# EAGLE board BEP33_6panel_90Grad (EAGLE 6.5.0), part 1 of 4
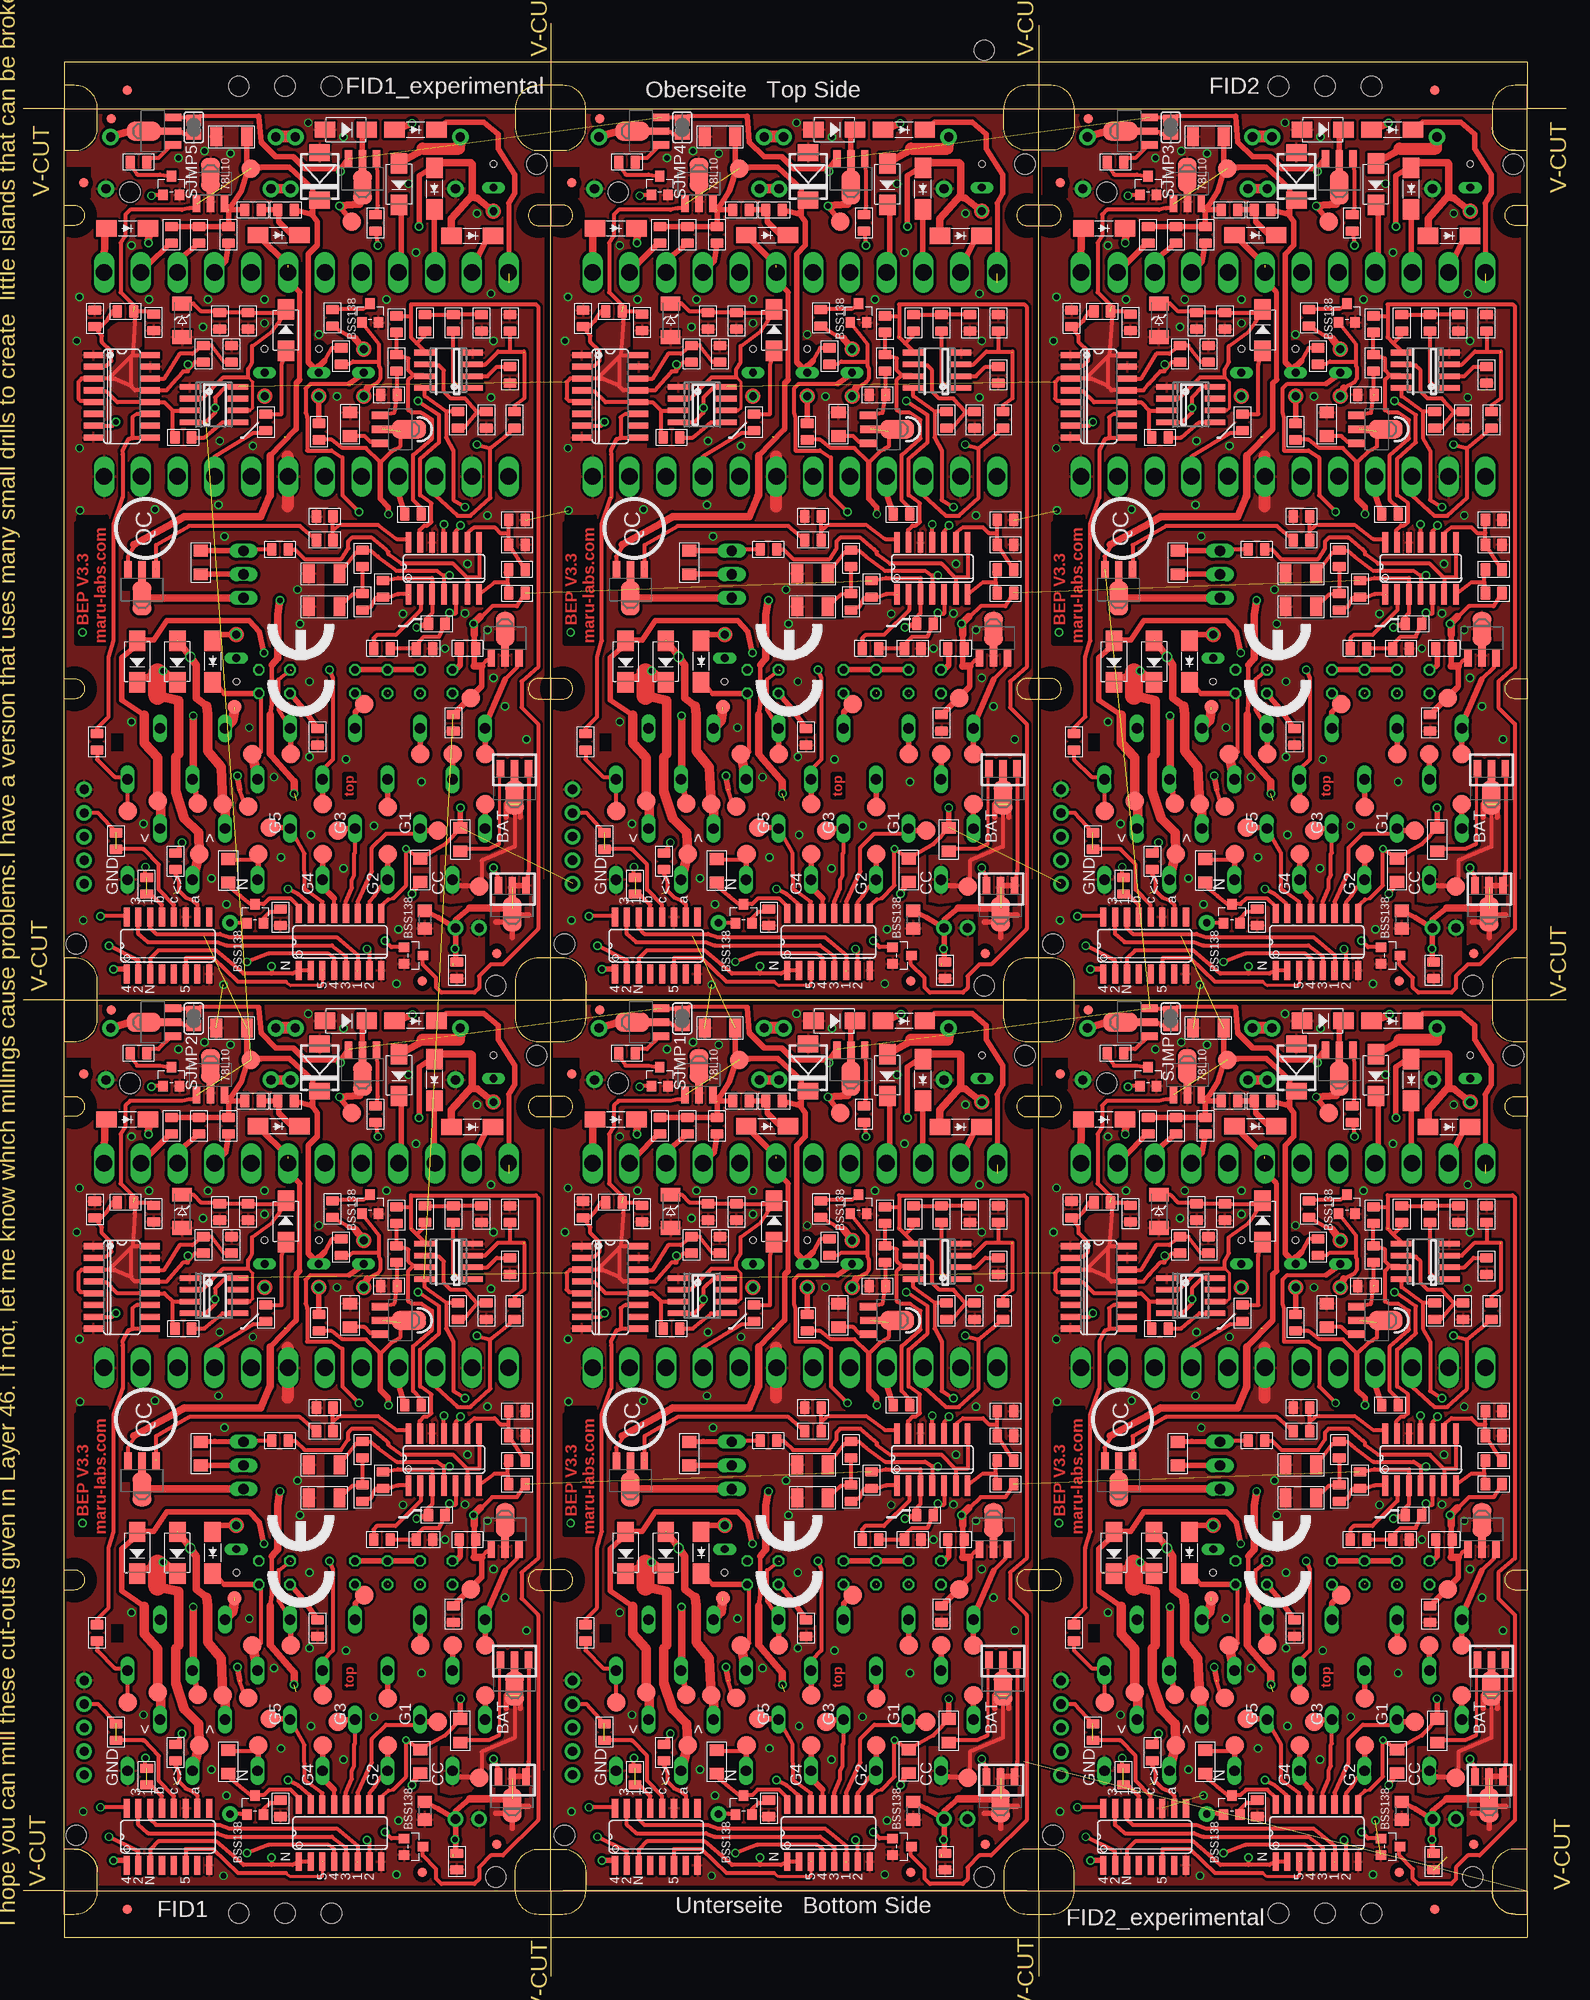
[diagram p13: board, top side]
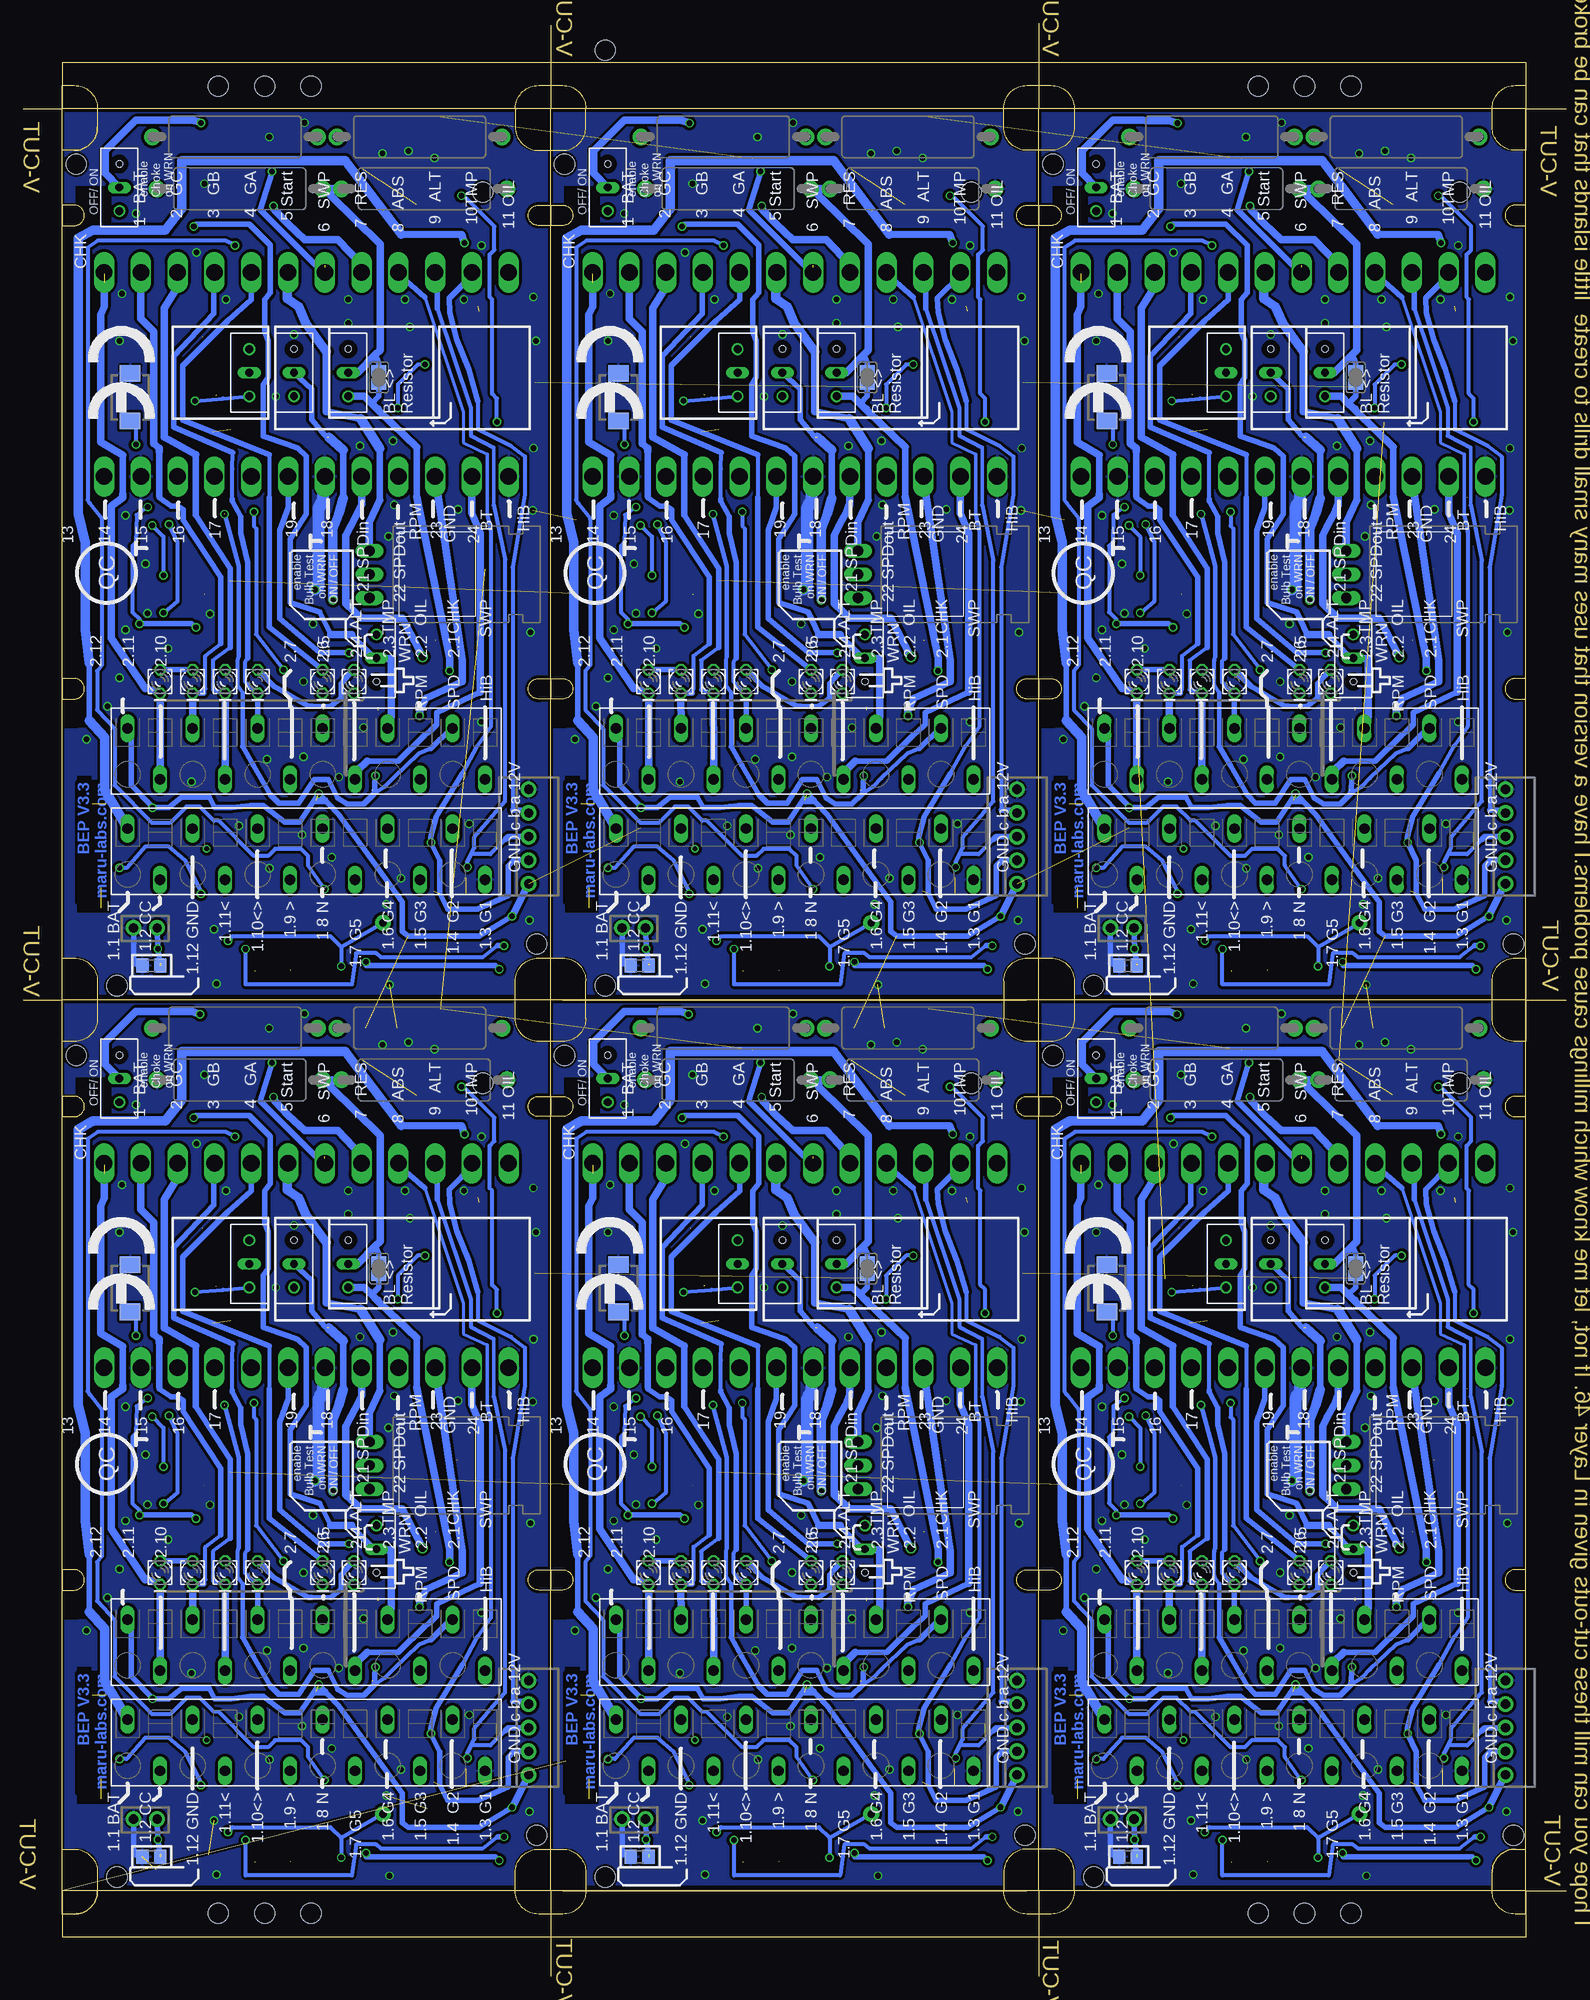
[diagram p14: board, bottom side, seen from below]

Size 166.2 x 210.4 mm. Coordinates in mm from the lower left corner, seen from the top.
Outline: 43 segments
Copper layers (1*16): Top 0.035mm / dielectric 1.5mm / Bottom 0.035mm
Design rules "Vorlage BEP3 und hoeher multi-cb_035um-cu": minimum track width 6mil, minimum drill 12mil, track to track 12mil, track to pad 12mil, pad to pad 6mil, via to via 6mil, smd to smd 6mil, copper to edge 10mil, drill to drill 8mil, minimum pad ring 8mil, minimum via ring 6mil, stop-mask expansion 3mil, vias tented up to drill 0mil, thermal gap 8mil
Holes 2.18 mm at 156.1,10.7 116.7,96.2 160.5,99.2 110.9,15.2 23.2,6.8 145.2,6.8 140.2,6.8 28.2,6.8 103.5,207.5 23.2,203.6 145.2,203.6 140.2,203.6 28.2,203.6 135.2,6.8 33.2,6.8 33.2,203.6 135.2,203.6 103.5,10.7 64.1,96.2 107.9,99.2 58.3,15.2 50.9,10.7 11.5,96.2 55.3,99.2 5.7,15.2 156.1,106.7 116.7,192.2 160.5,195.2 110.9,111.2 103.5,106.7 64.1,192.2 107.9,195.2 58.3,111.2 50.9,106.7 11.5,192.2 55.3,195.2 5.7,111.2
tRestrict: area 137.7,50.2 to 141,56.7; area 114.7,36 to 116,37.9; area 143.4,67.6 to 145.4,69.4; area 115.8,53.3 to 120.1,54.7; area 154.8,46.5 to 159.3,47.8; area 156.1,19.2 to 159.6,20.6; area 138.4,97.6 to 139.6,99.2; area 109.8,95.6 to 112.5,98.9; area 119.8,68.7 to 121,72.9; area 126.3,22.6 to 128,23.7; area 109.4,16.5 to 109.4,91.2; area 111.1,47.6 to 114.2,61.3; 96 more areas
bRestrict: area 156.9,18.6 to 160.4,28.8; area 158.9,28.7 to 160.4,33.3; area 158.9,38.5 to 161.1,45; area 156.7,90.8 to 160.5,96.8; area 109.5,41.5 to 111.9,43.9; area 109.4,41.3 to 110.8,44.1; area 109.5,92.5 to 111.9,94.9; area 109.4,92.3 to 110.8,95.1; area 159.4,92.4 to 162,95; area 159.3,41.4 to 162,44; area 160.3,38.5 to 162,45.6; area 109.4,100.8 to 113.1,105; 72 more areas
Milling: 188 lines

## Footprints (pad centres in the part's own frame; a part is rotated, then mirrored left to right if it is on the bottom)
12-PIN = drill 1.118 long: 1 19.25,-2.45; 2 15.75,3.05; 3 12.25,-2.45; 4 8.75,3.05; 5 5.25,-2.45; 6 1.75,3.05; 7 -1.75,-2.45; 8 -5.25,3.05; 9 -8.75,-2.45; 10 -12.25,3.05; 11 -15.75,-2.45; 12 -19.25,3.05
B2.0 = smd 2 x 2: TP 0,0
C1206 = smd 1.27 x 2.032: 1 -1.651,0; 2 1.651,0
C0805 = smd 1.397 x 1.016: 1 0,0.889; 2 0,-0.889
DO-214AC_SLIM = smd 2.2 x 1.77: 1 -2.242,0; 2 2.242,0
DO-214AC = smd 2.2 x 1.77: 1 -2.242,0; 2 2.242,0
SOD-123_MINI-SMA = smd 1.5 x 2.1: A 1.8,0; C -1.8,0
DO214AA = smd 1.8 x 2.2: A 2.55,0; C -2.55,0
DO214AA_BI = smd 1.8 x 2.2: A 2.45,0; C -2.65,0
FIDUCIAL_1MM = smd 1 x 1: 1 0,0
FIDUCIAL_1MM_WITH_SOLDERMASK = smd 1 x 1: 1 0,0
SO16 = smd 0.66 x 2.032: 1 -4.445,-3.073; 2 -3.175,-3.073; 3 -1.905,-3.073; 4 -0.635,-3.073; 5 0.635,-3.073; 6 1.905,-3.073; 7 3.175,-3.073; 8 4.445,-3.073; 9 4.445,3.073; 10 3.175,3.073; 11 1.905,3.073; 12 0.635,3.073; 13 -0.635,3.073; 14 -1.905,3.073; 15 -3.175,3.073; 16 -4.445,3.073
TO220H_NOHOLE = drill 1.118 long: 1 -2.54,-10.16; 2 0,-10.16; 3 2.54,-10.16
SO14 = smd 0.6 x 2.2: 1 -3.81,-2.8; 2 -2.54,-2.8; 3 -1.27,-2.8; 4 0,-2.8; 5 1.27,-2.8; 6 2.54,-2.8; 7 3.81,-2.8; 8 3.81,2.8; 9 2.54,2.8; 10 1.27,2.8; 11 0,2.8; 12 -1.27,2.8; 13 -2.54,2.8; 14 -3.81,2.8
SOT89_ROUND = smd 0.8 x 1.8: 1 -1.499,-2.181; 3 1.499,-2.181 | smd 0.8 x 2.3: 2 0,-1.927 | smd 2.032 x 3.65: 2@1 0,0.94
SO08 = smd 0.6 x 2.2: 1 -1.905,-2.6; 2 -0.635,-2.6; 3 0.635,-2.6; 4 1.905,-2.6; 5 1.905,2.6; 6 0.635,2.6; 7 -0.635,2.6; 8 -1.905,2.6
JP2_SMALLPADS = drill 0.85: 1 -2.54,0 | drill 0.85 long: 2 0,0 | hole 0.7: 2.54,0
JP2_ORIG_SMALLPADS = drill 0.85: 1 -2.54,0; 3 2.54,0 | drill 0.85 long: 2 0,0
LD260 = drill 0.813 octagon: A -1.27,0; K 1.27,0
SOT-23 = smd 1.016 x 1.143: 1 -0.889,-1.016; 2 0.889,-1.016; 3 0,1.016
SOT89 = smd 0.8 x 1.8: 1 -1.499,-2.181; 3 1.499,-2.181 | smd 0.8 x 2.3: 2 0,-1.927 | smd 2.032 x 3.65: 2@1 0,0.94
R0805 = smd 1.397 x 1.016: 1 0,0.889; 2 0,-0.889
R1206 = smd 1.27 x 1.524: 1 -1.27,0; 2 1.27,0
V235/17_1MM = drill 1 pad 1.778: 1 -8.89,0; 2 8.89,0
R0805' = smd 1.3 x 1.5: 1 -0.95,0; 2 0.95,0
SJ = smd 1.2 x 1.6: 1 -0.725,0; 2 0.725,0
SJ' = smd 1.168 x 1.6: 1 -0.762,0; 2 0.762,0
B1,27 = smd 1.5 x 1.5: TP 0,0
24-PIN_V2 = drill 1.778 long: 1 -21.78,-11; 2 -17.82,-11; 3 -13.86,-11; 4 -9.9,-11; 5 -5.94,-11; 6 -1.98,-11; 7 1.98,-11; 8 5.94,-11; 9 9.9,-11; 10 13.86,-11; 11 17.82,-11; 12 21.78,-11; 13 -21.78,11; 14 -17.82,11; 15 -13.86,11; 16 -9.9,11; 17 -5.94,11; 18 -1.98,11; 19 1.98,11; 20 5.94,11; 21 9.9,11; 22 13.86,11; 23 17.82,11; 24 21.78,11
22-23-2051 = drill 1 pad 1.676: 1 -5.08,0; 2 -2.54,0; 3 0,0; 4 2.54,0; 5 5.08,0
22-23-2021 = drill 1 pad 1.676: 1 -1.27,0; 2 1.27,0

## Placement (x,y rotation side)
1  [12-PIN]  135.7,25.19 180 bottom
2  [12-PIN]  135.7,35.98 180 bottom
3  [12-PIN]  83.1,25.19 180 bottom
4  [12-PIN]  83.1,35.98 180 bottom
5  [12-PIN]  30.5,25.19 180 bottom
6  [12-PIN]  30.5,35.98 180 bottom
6V  TPSB2.0  [B2.0]  153.42,41.7 90 top
6V1  TPSB2.0  [B2.0]  100.82,41.7 90 top
6V2  TPSB2.0  [B2.0]  48.22,41.7 90 top
6V3  TPSB2.0  [B2.0]  153.42,137.7 90 top
6V4  TPSB2.0  [B2.0]  100.82,137.7 90 top
6V5  TPSB2.0  [B2.0]  48.22,137.7 90 top
7  [12-PIN]  135.7,121.19 180 bottom
8  [12-PIN]  135.7,131.98 180 bottom
9  [12-PIN]  83.1,121.19 180 bottom
10  [12-PIN]  83.1,131.98 180 bottom
10V  TPSB2.0  [B2.0]  129.7,98.7 90 top
10V1  TPSB2.0  [B2.0]  77.1,98.7 90 top
10V2  TPSB2.0  [B2.0]  24.5,98.7 90 top
10V3  TPSB2.0  [B2.0]  129.7,194.7 90 top
10V4  TPSB2.0  [B2.0]  77.1,194.7 90 top
10V5  TPSB2.0  [B2.0]  24.5,194.7 90 top
11  [12-PIN]  30.5,121.19 180 bottom
12  [12-PIN]  30.5,131.98 180 bottom
C1  100u  [C1206]  85.01,51.54 180 top
C2  10u  [C1206]  127.64,102.16 180 top
C3  100u  [C1206]  85.01,55.1 180 top
C4  100nF,  [C0805]  98.92,39.03 0 top
C5  4.7u  [C0805]  105.01,82.1 180 top
C6  100nF.  [C0805]  105.77,58.21 90 top
C7  100nF.  [C0805]  85.07,61.26 90 top
C8  2.2nF  [C0805]  76.82,82.34 180 top
C9  100nF  [C0805]  66.65,82.16 0 top
C10  100nF  [C0805]  75.04,78.78 180 top
C11  100nF,  [C0805]  101.96,82.1 0 top
C12  4.7u  [C0805]  60.31,82.61 0 top
C13  10u  [C1206]  75.04,102.16 180 top
C14  100u  [C1206]  32.41,51.54 180 top
C15  4.7u  [C0805]  112.91,82.61 0 top
C16  100u  [C1206]  32.41,55.1 180 top
C17  100nF,  [C0805]  46.32,39.03 0 top
C18  4.7u  [C0805]  52.41,82.1 180 top
C19  100nF.  [C0805]  53.17,58.21 90 top
C20  100nF.  [C0805]  32.47,61.26 90 top
C21  2.2nF  [C0805]  24.22,82.34 180 top
C22  100nF  [C0805]  14.05,82.16 0 top
C23  100nF  [C0805]  22.44,78.78 180 top
C24  100nF,  [C0805]  49.36,82.1 0 top
C25  4.7u  [C0805]  7.71,82.61 0 top
C26  10u  [C1206]  22.44,102.16 180 top
C27  100u  [C1206]  137.61,147.54 180 top
C28  100u  [C1206]  137.61,151.1 180 top
C29  100nF,  [C0805]  151.52,135.03 0 top
C30  4.7u  [C0805]  157.61,178.1 180 top
C31  100nF.  [C0805]  158.37,154.21 90 top
C32  100nF.  [C0805]  137.67,157.26 90 top
C33  2.2nF  [C0805]  129.42,178.34 180 top
C34  100nF  [C0805]  119.25,178.16 0 top
C35  100nF  [C0805]  127.64,174.78 180 top
C36  100nF,  [C0805]  154.56,178.1 0 top
C37  4.7u  [C0805]  112.91,178.61 0 top
C38  10u  [C1206]  127.64,198.16 180 top
C39  100u  [C1206]  85.01,147.54 180 top
C40  100u  [C1206]  85.01,151.1 180 top
C41  100nF,  [C0805]  98.92,135.03 0 top
C42  4.7u  [C0805]  105.01,178.1 180 top
C43  100nF.  [C0805]  105.77,154.21 90 top
C44  100nF.  [C0805]  85.07,157.26 90 top
C45  2.2nF  [C0805]  76.82,178.34 180 top
C46  100nF  [C0805]  66.65,178.16 0 top
C47  100nF  [C0805]  75.04,174.78 180 top
C48  100nF,  [C0805]  101.96,178.1 0 top
C49  4.7u  [C0805]  60.31,178.61 0 top
C50  10u  [C1206]  75.04,198.16 180 top
C51  100u  [C1206]  32.41,147.54 180 top
C52  100u  [C1206]  32.41,151.1 180 top
C53  100nF,  [C0805]  46.32,135.03 0 top
C54  4.7u  [C0805]  52.41,178.1 180 top
C55  100nF.  [C0805]  53.17,154.21 90 top
C56  100nF.  [C0805]  32.47,157.26 90 top
C57  2.2nF  [C0805]  24.22,178.34 180 top
C58  100nF  [C0805]  14.05,178.16 0 top
C59  100nF  [C0805]  22.44,174.78 180 top
C60  100nF,  [C0805]  49.36,178.1 0 top
C61  4.7u  [C0805]  7.71,178.61 0 top
C62  10u  [C1206]  22.44,198.16 180 top
C101  4.7u  [C0805]  157.61,82.1 180 top
C102  100nF  [C0805]  119.25,82.16 0 top
C103  100nF,  [C0805]  154.56,82.1 0 top
C104  100nF,  [C0805]  151.52,39.03 0 top
C105  100nF.  [C0805]  158.37,58.21 90 top
C106  100nF.  [C0805]  137.67,61.26 90 top
C107  100u  [C1206]  137.61,51.54 180 top
C108  100u  [C1206]  137.61,55.1 180 top
C109  2.2nF  [C0805]  129.42,82.34 180 top
C110  100nF  [C0805]  127.64,78.78 180 top
D1  1N5817  [DO-214AC_SLIM]  132.71,91.56 0 top
D2  1N5817.  [DO-214AC_SLIM]  116.42,92.3 0 top
D3  1N4007,  [DO-214AC]  69.2,45.64 270 top
D4  Zen11  [SOD-123_MINI-SMA]  122.32,82.4 270 top
D5  1N4007,  [DO-214AC]  64.88,45.64 270 top
D6  1N4007.  [DO-214AC]  93.07,97.07 270 top
D7  1N5817  [DO-214AC_SLIM]  96.88,96.56 270 top
D8  1N5817.  [DO-214AC_SLIM]  100.96,91.5 0 top
D9  1N5817.  [DO-214AC_SLIM]  94.85,102.93 0 top
D10  1N5817  [DO-214AC_SLIM]  73.01,45.64 270 top
D11  1N4007.  [DO-214AC]  87.36,102.93 0 top
D12  1N4007  [DO-214AC]  80.88,81.32 90 top
D13  Zen15  [DO214AA]  84.53,97.89 90 top
D14  SM6TDO214AA_BI  [DO214AA_BI]  102.09,74.21 90 bottom
D15  1N5817  [DO-214AC_SLIM]  80.11,91.56 0 top
D16  1N5817.  [DO-214AC_SLIM]  63.82,92.3 0 top
D17  Zen11  [SOD-123_MINI-SMA]  69.72,82.4 270 top
D18  1N4007,  [DO-214AC]  16.6,45.64 270 top
D19  1N4007,  [DO-214AC]  12.28,45.64 270 top
D20  1N4007.  [DO-214AC]  40.47,97.07 270 top
D21  1N5817  [DO-214AC_SLIM]  44.28,96.56 270 top
D22  1N5817.  [DO-214AC_SLIM]  48.36,91.5 0 top
D23  1N5817.  [DO-214AC_SLIM]  42.25,102.93 0 top
D24  1N5817  [DO-214AC_SLIM]  20.41,45.64 270 top
D25  1N4007.  [DO-214AC]  34.76,102.93 0 top
D26  1N4007  [DO-214AC]  28.28,81.32 90 top
D27  Zen15  [DO214AA]  31.93,97.89 90 top
D28  SM6TDO214AA_BI  [DO214AA_BI]  49.49,74.21 90 bottom
D29  1N5817  [DO-214AC_SLIM]  27.51,91.56 0 top
D30  1N5817.  [DO-214AC_SLIM]  11.22,92.3 0 top
D31  Zen11  [SOD-123_MINI-SMA]  17.12,82.4 270 top
D32  1N4007,  [DO-214AC]  121.8,141.64 270 top
D33  1N4007,  [DO-214AC]  117.48,141.64 270 top
D34  1N4007.  [DO-214AC]  145.67,193.07 270 top
D35  1N5817  [DO-214AC_SLIM]  149.48,192.56 270 top
D36  1N5817.  [DO-214AC_SLIM]  153.56,187.5 0 top
D37  1N5817.  [DO-214AC_SLIM]  147.45,198.93 0 top
D38  1N5817  [DO-214AC_SLIM]  125.61,141.64 270 top
D39  1N4007.  [DO-214AC]  139.96,198.93 0 top
D40  1N4007  [DO-214AC]  133.48,177.32 90 top
D41  Zen15  [DO214AA]  137.13,193.89 90 top
D42  SM6TDO214AA_BI  [DO214AA_BI]  154.69,170.21 90 bottom
D43  1N5817  [DO-214AC_SLIM]  132.71,187.56 0 top
D44  1N5817.  [DO-214AC_SLIM]  116.42,188.3 0 top
D45  Zen11  [SOD-123_MINI-SMA]  122.32,178.4 270 top
D46  1N4007,  [DO-214AC]  69.2,141.64 270 top
D47  1N4007,  [DO-214AC]  64.88,141.64 270 top
D48  1N4007.  [DO-214AC]  93.07,193.07 270 top
D49  1N5817  [DO-214AC_SLIM]  96.88,192.56 270 top
D50  1N5817.  [DO-214AC_SLIM]  100.96,187.5 0 top
D51  1N5817.  [DO-214AC_SLIM]  94.85,198.93 0 top
D52  1N5817  [DO-214AC_SLIM]  73.01,141.64 270 top
D53  1N4007.  [DO-214AC]  87.36,198.93 0 top
D54  1N4007  [DO-214AC]  80.88,177.32 90 top
D55  Zen15  [DO214AA]  84.53,193.89 90 top
D56  SM6TDO214AA_BI  [DO214AA_BI]  102.09,170.21 90 bottom
D57  1N5817  [DO-214AC_SLIM]  80.11,187.56 0 top
D58  1N5817.  [DO-214AC_SLIM]  63.82,188.3 0 top
D59  Zen11  [SOD-123_MINI-SMA]  69.72,178.4 270 top
D60  1N4007,  [DO-214AC]  16.6,141.64 270 top
D61  1N4007,  [DO-214AC]  12.28,141.64 270 top
D62  1N4007.  [DO-214AC]  40.47,193.07 270 top
D63  1N5817  [DO-214AC_SLIM]  44.28,192.56 270 top
D64  1N5817.  [DO-214AC_SLIM]  48.36,187.5 0 top
D65  1N5817.  [DO-214AC_SLIM]  42.25,198.93 0 top
D66  1N5817  [DO-214AC_SLIM]  20.41,141.64 270 top
D67  1N4007.  [DO-214AC]  34.76,198.93 0 top
D68  1N4007  [DO-214AC]  28.28,177.32 90 top
D69  Zen15  [DO214AA]  31.93,193.89 90 top
D70  SM6TDO214AA_BI  [DO214AA_BI]  49.49,170.21 90 bottom
D71  1N5817  [DO-214AC_SLIM]  27.51,187.56 0 top
D72  1N5817.  [DO-214AC_SLIM]  11.22,188.3 0 top
D73  Zen11  [SOD-123_MINI-SMA]  17.12,178.4 270 top
D101  Zen15  [DO214AA]  137.13,97.89 90 top
D102  1N4007,  [DO-214AC]  121.8,45.64 270 top
D103  1N4007,  [DO-214AC]  117.48,45.64 270 top
D104  SM6TDO214AA_BI  [DO214AA_BI]  154.69,74.21 90 bottom
D105  1N4007.  [DO-214AC]  139.96,102.93 0 top
D106  1N4007.  [DO-214AC]  145.67,97.07 270 top
D107  1N5817  [DO-214AC_SLIM]  149.48,96.56 270 top
D108  1N5817.  [DO-214AC_SLIM]  153.56,91.5 0 top
D109  1N5817.  [DO-214AC_SLIM]  147.45,102.93 0 top
D110  1N5817  [DO-214AC_SLIM]  125.61,45.64 270 top
D112  1N4007  [DO-214AC]  133.48,81.32 90 top
FID1  FIDUCIAL  [FIDUCIAL_1MM]  152,203.2 90 top
FID1B  FIDUCIALFIDUCIAL_1MM_WITH_SOLDERMASK  [FIDUCIAL_1MM_WITH_SOLDERMASK]  11.2,203.2 90 top
FID2  FIDUCIAL  [FIDUCIAL_1MM]  11.2,7.2 90 top
FID2B  FIDUCIALFIDUCIAL_1MM_WITH_SOLDERMASK  [FIDUCIAL_1MM_WITH_SOLDERMASK]  152,7.2 90 top
FID3  FIDUCIAL  [FIDUCIAL_1MM]  59.1,97.2 90 top
FID4  FIDUCIAL  [FIDUCIAL_1MM]  95.6,11.2 90 top
FID5  FIDUCIAL  [FIDUCIAL_1MM]  103.6,14.2 90 top
FID6  FIDUCIAL  [FIDUCIAL_1MM]  62.1,104.1 90 top
FID7  FIDUCIAL  [FIDUCIAL_1MM]  6.5,97.2 90 top
FID8  FIDUCIAL  [FIDUCIAL_1MM]  43,11.2 90 top
FID9  FIDUCIAL  [FIDUCIAL_1MM]  51,14.2 90 top
FID10  FIDUCIAL  [FIDUCIAL_1MM]  9.5,104.1 90 top
FID11  FIDUCIAL  [FIDUCIAL_1MM]  111.7,193.2 90 top
FID12  FIDUCIAL  [FIDUCIAL_1MM]  148.2,107.2 90 top
FID13  FIDUCIAL  [FIDUCIAL_1MM]  156.2,110.2 90 top
FID14  FIDUCIAL  [FIDUCIAL_1MM]  114.7,200.1 90 top
FID15  FIDUCIAL  [FIDUCIAL_1MM]  59.1,193.2 90 top
FID16  FIDUCIAL  [FIDUCIAL_1MM]  95.6,107.2 90 top
FID17  FIDUCIAL  [FIDUCIAL_1MM]  103.6,110.2 90 top
FID18  FIDUCIAL  [FIDUCIAL_1MM]  62.1,200.1 90 top
FID19  FIDUCIAL  [FIDUCIAL_1MM]  6.5,193.2 90 top
FID20  FIDUCIAL  [FIDUCIAL_1MM]  43,107.2 90 top
FID21  FIDUCIAL  [FIDUCIAL_1MM]  51,110.2 90 top
FID22  FIDUCIAL  [FIDUCIAL_1MM]  9.5,200.1 90 top
FID101  FIDUCIAL  [FIDUCIAL_1MM]  111.7,97.2 90 top
FID102  FIDUCIAL  [FIDUCIAL_1MM]  148.2,11.2 90 top
FID103  FIDUCIAL  [FIDUCIAL_1MM]  156.2,14.2 90 top
FID104  FIDUCIAL  [FIDUCIAL_1MM]  114.7,104.1 90 top
IC1  4028  [SO16]  68.18,15.03 0 top
IC2  317TO202H_NOHOLE  [TO220H_NOHOLE]  66.15,55.04 270 bottom
IC3  ULN2004  [SO16]  86.72,15.43 0 top
IC4  LM339  [SO14]  97.9,55.67 0 top
IC5  78L06  [SOT89_ROUND]  104.5,48.18 0 top
IC6  555  [SO08]  73.14,73.32 270 top
IC7  4538  [SO16]  63.23,74.21 270 top
IC8  78L10  [SOT89_ROUND]  72.78,97.11 0 top
IC9  LM2904  [SO08]  98.41,77.01 90 top
IC10  4028  [SO16]  15.58,15.03 0 top
IC11  317TO202H_NOHOLE  [TO220H_NOHOLE]  13.55,55.04 270 bottom
IC12  ULN2004  [SO16]  34.12,15.43 0 top
IC13  LM339  [SO14]  45.3,55.67 0 top
IC14  78L06  [SOT89_ROUND]  51.9,48.18 0 top
IC15  555  [SO08]  20.54,73.32 270 top
IC16  4538  [SO16]  10.63,74.21 270 top
IC17  78L10  [SOT89_ROUND]  20.18,97.11 0 top
IC18  LM2904  [SO08]  45.81,77.01 90 top
IC19  4028  [SO16]  120.78,111.03 0 top
IC20  317TO202H_NOHOLE  [TO220H_NOHOLE]  118.75,151.03 270 bottom
IC21  ULN2004  [SO16]  139.32,111.43 0 top
IC22  LM339  [SO14]  150.5,151.67 0 top
IC23  78L06  [SOT89_ROUND]  157.1,144.18 0 top
IC24  555  [SO08]  125.73,169.32 270 top
IC25  4538  [SO16]  115.83,170.21 270 top
IC26  78L10  [SOT89_ROUND]  125.38,193.11 0 top
IC27  LM2904  [SO08]  151.01,173.01 90 top
IC28  4028  [SO16]  68.18,111.03 0 top
IC29  317TO202H_NOHOLE  [TO220H_NOHOLE]  66.15,151.03 270 bottom
IC30  ULN2004  [SO16]  86.72,111.43 0 top
IC31  LM339  [SO14]  97.9,151.67 0 top
IC32  78L06  [SOT89_ROUND]  104.5,144.18 0 top
IC33  555  [SO08]  73.14,169.32 270 top
IC34  4538  [SO16]  63.23,170.21 270 top
IC35  78L10  [SOT89_ROUND]  72.78,193.11 0 top
IC36  LM2904  [SO08]  98.41,173.01 90 top
IC37  4028  [SO16]  15.58,111.03 0 top
IC38  317TO202H_NOHOLE  [TO220H_NOHOLE]  13.55,151.03 270 bottom
IC39  ULN2004  [SO16]  34.12,111.43 0 top
IC40  LM339  [SO14]  45.3,151.67 0 top
IC41  78L06  [SOT89_ROUND]  51.9,144.18 0 top
IC42  555  [SO08]  20.54,169.32 270 top
IC43  4538  [SO16]  10.63,170.21 270 top
IC44  78L10  [SOT89_ROUND]  20.18,193.11 0 top
IC45  LM2904  [SO08]  45.81,173.01 90 top
IC101  LM2904  [SO08]  151.01,77.01 90 top
IC102  78L06  [SOT89_ROUND]  157.1,48.18 0 top
IC104  78L10  [SOT89_ROUND]  125.38,97.11 0 top
IC105  4028  [SO16]  120.78,15.03 0 top
IC107  ULN2004  [SO16]  139.32,15.43 0 top
IC108  LM339  [SO14]  150.5,55.67 0 top
IC109  317TO202H_NOHOLE  [TO220H_NOHOLE]  118.75,55.04 270 bottom
IC110  555  [SO08]  125.73,73.32 270 top
IC111  4538  [SO16]  115.83,74.21 270 top
JP1  [JP2_SMALLPADS]  84.44,76.75 90 bottom
JP2  JP2E_ORIG  [JP2_ORIG_SMALLPADS]  89.26,76.75 90 bottom
JP3  [JP2_SMALLPADS]  103.25,96.7 90 bottom
JP4  [JP2_SMALLPADS]  75.55,46.02 270 bottom
JP5  [JP2_SMALLPADS]  78.6,76.75 90 bottom
JP6  [JP2_SMALLPADS]  31.84,76.75 90 bottom
JP7  JP2E_ORIG  [JP2_ORIG_SMALLPADS]  36.66,76.75 90 bottom
JP8  [JP2_SMALLPADS]  50.65,96.7 90 bottom
JP9  [JP2_SMALLPADS]  22.95,46.02 270 bottom
JP10  [JP2_SMALLPADS]  26,76.75 90 bottom
JP11  [JP2_SMALLPADS]  137.04,172.75 90 bottom
JP12  JP2E_ORIG  [JP2_ORIG_SMALLPADS]  141.86,172.75 90 bottom
JP13  [JP2_SMALLPADS]  155.85,192.7 90 bottom
JP14  [JP2_SMALLPADS]  128.15,142.02 270 bottom
JP15  [JP2_SMALLPADS]  131.2,172.75 90 bottom
JP16  [JP2_SMALLPADS]  84.44,172.75 90 bottom
JP17  JP2E_ORIG  [JP2_ORIG_SMALLPADS]  89.26,172.75 90 bottom
JP18  [JP2_SMALLPADS]  103.25,192.7 90 bottom
JP19  [JP2_SMALLPADS]  75.55,142.02 270 bottom
JP20  [JP2_SMALLPADS]  78.6,172.75 90 bottom
JP21  [JP2_SMALLPADS]  31.84,172.75 90 bottom
JP22  JP2E_ORIG  [JP2_ORIG_SMALLPADS]  36.66,172.75 90 bottom
JP23  [JP2_SMALLPADS]  50.65,192.7 90 bottom
JP24  [JP2_SMALLPADS]  22.95,142.02 270 bottom
JP25  [JP2_SMALLPADS]  26,172.75 90 bottom
JP101  [JP2_SMALLPADS]  137.04,76.75 90 bottom
JP102  [JP2_SMALLPADS]  155.85,96.7 90 bottom
JP103  [JP2_SMALLPADS]  128.15,46.02 270 bottom
JP104  [JP2_SMALLPADS]  131.2,76.75 90 bottom
JP105  JP2E_ORIG  [JP2_ORIG_SMALLPADS]  141.86,76.75 90 bottom
LED1  [LD260]  98.85,43.48 270 bottom
LED2  [LD260]  95.35,43.48 270 bottom
LED3  [LD260]  91.85,43.48 270 bottom
LED4  [LD260]  88.35,43.48 270 bottom
LED5  [LD260]  81.35,43.48 270 bottom
LED6  [LD260]  77.98,43.48 270 bottom
LED7  [LD260]  46.25,43.48 270 bottom
LED8  [LD260]  42.75,43.48 270 bottom
LED9  [LD260]  39.25,43.48 270 bottom
LED10  [LD260]  35.75,43.48 270 bottom
LED11  [LD260]  28.75,43.48 270 bottom
LED12  [LD260]  25.38,43.48 270 bottom
LED13  [LD260]  151.45,139.48 270 bottom
LED14  [LD260]  147.95,139.48 270 bottom
LED15  [LD260]  144.45,139.48 270 bottom
LED16  [LD260]  140.95,139.48 270 bottom
LED17  [LD260]  133.95,139.48 270 bottom
LED18  [LD260]  130.58,139.48 270 bottom
LED19  [LD260]  98.85,139.48 270 bottom
LED20  [LD260]  95.35,139.48 270 bottom
LED21  [LD260]  91.85,139.48 270 bottom
LED22  [LD260]  88.35,139.48 270 bottom
LED23  [LD260]  81.35,139.48 270 bottom
LED24  [LD260]  77.98,139.48 270 bottom
LED25  [LD260]  46.25,139.48 270 bottom
LED26  [LD260]  42.75,139.48 270 bottom
LED27  [LD260]  39.25,139.48 270 bottom
LED28  [LD260]  35.75,139.48 270 bottom
LED29  [LD260]  28.75,139.48 270 bottom
LED30  [LD260]  25.38,139.48 270 bottom
LED101  [LD260]  133.95,43.48 270 bottom
LED102  [LD260]  151.45,43.48 270 bottom
LED103  [LD260]  147.95,43.48 270 bottom
LED104  [LD260]  144.45,43.48 270 bottom
LED105  [LD260]  140.95,43.48 270 bottom
LED106  [LD260]  130.58,43.48 270 bottom
Q1  J1  [SOT-23]  147.24,13.97 270 top
Q2  BA  [SOT89]  119.12,102.77 90 top
Q3  J1  [SOT-23]  121.15,96.9 0 top
Q4  BA  [SOT89]  89.14,97.64 180 top
Q5  BA.  [SOT89]  105.27,19.35 180 top
Q6  BA.  [SOT89]  105.52,31.93 180 top
Q7  BA  [SOT89]  65.39,53.38 180 top
Q8  MY  [SOT89]  93.2,70.66 270 top
Q9  J1  [SOT-23]  89.96,83.17 0 top
Q10  J1  [SOT-23]  77.58,18.46 0 top
Q11  J1  [SOT-23]  94.64,13.97 270 top
Q12  BA  [SOT89]  66.52,102.77 90 top
Q13  J1  [SOT-23]  68.55,96.9 0 top
Q14  BA  [SOT89]  36.54,97.64 180 top
Q15  BA.  [SOT89]  52.67,19.35 180 top
Q16  BA.  [SOT89]  52.92,31.93 180 top
Q17  BA  [SOT89]  12.79,53.38 180 top
Q18  MY  [SOT89]  40.6,70.66 270 top
Q19  J1  [SOT-23]  37.36,83.17 0 top
Q20  J1  [SOT-23]  24.98,18.46 0 top
Q21  J1  [SOT-23]  42.04,13.97 270 top
Q22  BA  [SOT89]  13.92,102.77 90 top
Q23  J1  [SOT-23]  15.95,96.9 0 top
Q24  BA  [SOT89]  141.74,193.64 180 top
Q25  BA.  [SOT89]  157.87,115.35 180 top
Q26  BA.  [SOT89]  158.12,127.93 180 top
Q27  BA  [SOT89]  117.99,149.38 180 top
Q28  MY  [SOT89]  145.8,166.66 270 top
Q29  J1  [SOT-23]  142.56,179.17 0 top
Q30  J1  [SOT-23]  130.18,114.46 0 top
Q31  J1  [SOT-23]  147.24,109.97 270 top
Q32  BA  [SOT89]  119.12,198.77 90 top
Q33  J1  [SOT-23]  121.15,192.9 0 top
Q34  BA  [SOT89]  89.14,193.64 180 top
Q35  BA.  [SOT89]  105.27,115.35 180 top
Q36  BA.  [SOT89]  105.52,127.93 180 top
Q37  BA  [SOT89]  65.39,149.38 180 top
Q38  MY  [SOT89]  93.2,166.66 270 top
Q39  J1  [SOT-23]  89.96,179.17 0 top
Q40  J1  [SOT-23]  77.58,114.46 0 top
Q41  J1  [SOT-23]  94.64,109.97 270 top
Q42  BA  [SOT89]  66.52,198.77 90 top
Q43  J1  [SOT-23]  68.55,192.9 0 top
Q44  BA  [SOT89]  36.54,193.64 180 top
Q45  BA.  [SOT89]  52.67,115.35 180 top
Q46  BA.  [SOT89]  52.92,127.93 180 top
Q47  BA  [SOT89]  12.79,149.38 180 top
Q48  MY  [SOT89]  40.6,166.66 270 top
Q49  J1  [SOT-23]  37.36,179.17 0 top
Q50  J1  [SOT-23]  24.98,114.46 0 top
Q51  J1  [SOT-23]  42.04,109.97 270 top
Q52  BA  [SOT89]  13.92,198.77 90 top
Q53  J1  [SOT-23]  15.95,192.9 0 top
Q101  BA.  [SOT89]  158.12,31.93 180 top
Q102  BA.  [SOT89]  157.87,19.35 180 top
Q103  MY  [SOT89]  145.8,70.66 270 top
Q104  BA  [SOT89]  141.74,97.64 180 top
Q105  BA  [SOT89]  117.99,53.38 180 top
Q106  J1  [SOT-23]  130.18,18.46 0 top
Q107  J1  [SOT-23]  142.56,83.17 0 top
R1  104  [R0805]  115.2,26.3 180 top
R2  104  [R0805]  118.5,21.5 180 top
R3  104  [R0805]  121.6,24.1 180 top
R4  100  [R0805]  132.9,18.1 180 top
R5  13  [R1206]  140.4,71.2 90 top
R6  2201  [R0805]  144.6,74.36 270 top
R7  47  [V235/17_1MM]  90.79,102.15 0 bottom
R8  4701  [R0805]  117.62,99.43 270 top
R9  13  [R1206]  127.3,23.1 90 top
R10  104  [R0805]  116.21,83.37 90 top
R11  13  [R1206]  71.74,56.3 270 top
R12  100  [R0805]  133.48,94.29 90 top
R13  100  [R0805]  129.93,94.29 270 top
R14  47  [V235/17_1MM]  70.91,102.15 0 bottom
R15  104  [R0805]  68.56,91.61 180 top
R16  104  [R0805]  71.55,91.61 180 top
R17  104  [R0805]  74.72,91.61 180 top
R18  4701  [R0805]  105.52,71.67 0 top
R19  1002  [R0805]  105.01,76.5 180 top
R20  1002  [R0805]  80.25,57.7 270 top
R21  1502  [R0805]  105.77,53 90 top
R22  104  [R0805]  89.14,52.05 0 top
R23  104  [R0805]  89.14,56.75 0 top
R24  1502  [R0805]  97.14,49.7 270 top
R25  1002  [R0805]  95.8,47.03 270 top
R26  2201  [R0805]  91.23,47.03 90 top
R27  1002  [R0805]  91.36,53.45 0 top
R28  4701  [R0805]  85.07,58.72 90 top
R29  2702  [R0805]  105.77,60.88 270 top
R30  102  [R0805]  99.3,12.36 0 top
R31  R_user  [R0805']  99.81,12.87 180 bottom
R32  102  [R0805]  94.6,61.51 90 top
R33  (101)  [R0805]  84.31,37.51 0 top
R34  (1000)  [R0805]  100.44,47.03 90 top
R35  102  [R0805]  90.53,92.88 180 top
R36  13  [R1206]  95.36,23.16 270 top
R37  13  [R1206]  99.68,26.46 270 top
R38  2702  [R0805]  105.77,55.54 90 top
R39  4701  [R0805]  92.82,77.81 0 top
R40  100  [R0805]  85.9,82.66 180 top
R41  104  [R0805]  86.85,78.53 0 top
R42  104  [R0805]  73.77,82.34 0 top
R43  (1002)  [R0805]  69.83,69.77 90 top
R44  2702  [R0805]  78.72,71.42 0 top
R45  47  [V235/17_1MM]  90.28,96.56 0 bottom
R46  47  [V235/17_1MM]  70.4,96.56 180 bottom
R47  2702  [R0805]  71.99,78.78 0 top
R48  2201  [R0805]  84.44,70.4 180 top
R49  1002  [R0805]  60.56,37 180 top
R50  1002  [R0805]  98.92,82.1 0 top
R51  102  [R0805]  95.87,82.1 0 top
R52  2702  [R0805]  92.82,81.98 180 top
R53  1002  [R0805]  99.42,71.67 180 top
R54  1002  [R0805]  102.47,71.67 180 top
R55  R_user  [R0805']  95.87,17.84 270 top
R56  104  [R0805]  62.6,26.3 180 top
R57  104  [R0805]  65.9,21.5 180 top
R58  104  [R0805]  69,24.1 180 top
R59  13  [R1206]  87.8,71.2 90 top
R60  2201  [R0805]  92,74.36 270 top
R61  100  [R0805]  80.3,18.1 180 top
R62  13  [R1206]  74.7,23.1 90 top
R63  4701  [R0805]  65.02,99.43 270 top
R64  104  [R0805]  63.61,83.37 90 top
R65  100  [R0805]  80.88,94.29 90 top
R66  100  [R0805]  77.33,94.29 270 top
R67  47  [V235/17_1MM]  38.19,102.15 0 bottom
R68  13  [R1206]  19.14,56.3 270 top
R69  47  [V235/17_1MM]  18.31,102.15 0 bottom
R70  104  [R0805]  15.96,91.61 180 top
R71  104  [R0805]  18.95,91.61 180 top
R72  104  [R0805]  22.12,91.61 180 top
R73  4701  [R0805]  52.92,71.67 0 top
R74  1002  [R0805]  52.41,76.5 180 top
R75  1002  [R0805]  27.65,57.7 270 top
R76  1502  [R0805]  53.17,53 90 top
R77  104  [R0805]  36.54,52.05 0 top
R78  104  [R0805]  36.54,56.75 0 top
R79  1502  [R0805]  44.54,49.7 270 top
R80  1002  [R0805]  43.2,47.03 270 top
R81  2201  [R0805]  38.63,47.03 90 top
R82  1002  [R0805]  38.76,53.45 0 top
R83  4701  [R0805]  32.47,58.72 90 top
R84  2702  [R0805]  53.17,60.88 270 top
R85  102  [R0805]  46.7,12.36 0 top
R86  R_user  [R0805']  47.2,12.87 180 bottom
R87  102  [R0805]  42,61.51 90 top
R88  (101)  [R0805]  31.71,37.51 0 top
R89  (1000)  [R0805]  47.84,47.03 90 top
R90  102  [R0805]  37.93,92.88 180 top
R91  13  [R1206]  42.76,23.16 270 top
R92  13  [R1206]  47.08,26.46 270 top
R93  2702  [R0805]  53.17,55.54 90 top
R94  4701  [R0805]  40.22,77.81 0 top
R95  100  [R0805]  33.3,82.66 180 top
R96  104  [R0805]  34.25,78.53 0 top
R97  104  [R0805]  21.17,82.34 0 top
R98  (1002)  [R0805]  17.23,69.77 90 top
R99  2702  [R0805]  26.12,71.42 0 top
R100  47  [V235/17_1MM]  37.68,96.56 0 bottom
R101  102  [R0805]  151.9,12.36 0 top
R102  13  [R1206]  152.28,26.46 270 top
R103  R_user  [R0805']  148.47,17.84 270 top
R104  R_user  [R0805']  152.41,12.87 180 bottom
R105  4701  [R0805]  158.12,71.67 0 top
R106  13  [R1206]  147.96,23.16 270 top
R107  1002  [R0805]  157.61,76.5 180 top
R108  1002  [R0805]  151.52,82.1 0 top
R109  104  [R0805]  121.16,91.61 180 top
R110  104  [R0805]  124.15,91.61 180 top
R111  104  [R0805]  127.32,91.61 180 top
R112  102  [R0805]  148.47,82.1 0 top
R113  1002  [R0805]  152.02,71.67 180 top
R114  1002  [R0805]  155.07,71.67 180 top
R115  102  [R0805]  147.2,61.51 90 top
R116  4701  [R0805]  145.42,77.81 0 top
R117  2702  [R0805]  145.42,81.98 180 top
R118  47  [V235/17_1MM]  17.8,96.56 180 bottom
R119  2201  [R0805]  137.04,70.4 180 top
R120  1002  [R0805]  132.85,57.7 270 top
R121  1502  [R0805]  158.37,53 90 top
R122  2702  [R0805]  158.37,55.54 90 top
R123  2702  [R0805]  158.37,60.88 270 top
R124  1002  [R0805]  143.96,53.45 0 top
R125  104  [R0805]  141.74,52.05 0 top
R126  4701  [R0805]  137.67,58.72 90 top
R127  47  [V235/17_1MM]  143.39,102.15 0 bottom
R128  102  [R0805]  143.13,92.88 180 top
R129  47  [V235/17_1MM]  123.51,102.15 0 bottom
R130  104  [R0805]  141.74,56.75 0 top
R131  1502  [R0805]  149.74,49.7 270 top
R132  1002  [R0805]  148.4,47.03 270 top
R133  2201  [R0805]  143.83,47.03 90 top
R134  13  [R1206]  124.34,56.3 270 top
R135  104  [R0805]  139.45,78.53 0 top
R136  47  [V235/17_1MM]  142.88,96.56 0 bottom
R137  47  [V235/17_1MM]  123,96.56 180 bottom
R138  100  [R0805]  138.5,82.66 180 top
R139  2702  [R0805]  19.39,78.78 0 top
R140  2702  [R0805]  131.32,71.42 0 top
R141  104  [R0805]  126.37,82.34 0 top
R142  (1000)  [R0805]  153.04,47.03 90 top
R143  (101)  [R0805]  136.91,37.51 0 top
R144  (1002)  [R0805]  122.43,69.77 90 top
R145  2702  [R0805]  124.59,78.78 0 top
R146  1002  [R0805]  113.16,37 180 top
R147  2201  [R0805]  31.84,70.4 180 top
R148  1002  [R0805]  7.96,37 180 top
R149  1002  [R0805]  46.32,82.1 0 top
R150  102  [R0805]  43.27,82.1 0 top
R151  2702  [R0805]  40.22,81.98 180 top
R152  1002  [R0805]  46.82,71.67 180 top
R153  1002  [R0805]  49.87,71.67 180 top
R154  R_user  [R0805']  43.27,17.84 270 top
R155  104  [R0805]  10,26.3 180 top
R156  104  [R0805]  13.3,21.5 180 top
R157  104  [R0805]  16.4,24.1 180 top
R158  13  [R1206]  35.2,71.2 90 top
R159  2201  [R0805]  39.4,74.36 270 top
R160  100  [R0805]  27.7,18.1 180 top
R161  13  [R1206]  22.1,23.1 90 top
R162  4701  [R0805]  12.42,99.43 270 top
R163  104  [R0805]  11.01,83.37 90 top
R164  100  [R0805]  28.28,94.29 90 top
R165  100  [R0805]  24.73,94.29 270 top
R166  47  [V235/17_1MM]  143.39,198.15 0 bottom
R167  13  [R1206]  124.34,152.3 270 top
R168  47  [V235/17_1MM]  123.51,198.15 0 bottom
R169  104  [R0805]  121.16,187.61 180 top
R170  104  [R0805]  124.15,187.61 180 top
R171  104  [R0805]  127.32,187.61 180 top
R172  4701  [R0805]  158.12,167.67 0 top
R173  1002  [R0805]  157.61,172.5 180 top
R174  1002  [R0805]  132.85,153.7 270 top
R175  1502  [R0805]  158.37,149 90 top
R176  104  [R0805]  141.74,148.05 0 top
R177  104  [R0805]  141.74,152.75 0 top
R178  1502  [R0805]  149.74,145.7 270 top
R179  1002  [R0805]  148.4,143.03 270 top
R180  2201  [R0805]  143.83,143.03 90 top
R181  1002  [R0805]  143.96,149.45 0 top
R182  4701  [R0805]  137.67,154.72 90 top
R183  2702  [R0805]  158.37,156.88 270 top
R184  102  [R0805]  151.9,108.36 0 top
R185  R_user  [R0805']  152.41,108.87 180 bottom
R186  102  [R0805]  147.2,157.51 90 top
R187  (101)  [R0805]  136.91,133.51 0 top
R188  (1000)  [R0805]  153.04,143.03 90 top
R189  102  [R0805]  143.13,188.88 180 top
R190  13  [R1206]  147.96,119.16 270 top
R191  13  [R1206]  152.28,122.46 270 top
R192  2702  [R0805]  158.37,151.54 90 top
R193  4701  [R0805]  145.42,173.81 0 top
R194  100  [R0805]  138.5,178.66 180 top
R195  104  [R0805]  139.45,174.53 0 top
R196  104  [R0805]  126.37,178.34 0 top
R197  (1002)  [R0805]  122.43,165.77 90 top
R198  2702  [R0805]  131.32,167.42 0 top
R199  47  [V235/17_1MM]  142.88,192.56 0 bottom
R200  47  [V235/17_1MM]  123,192.56 180 bottom
R201  2702  [R0805]  124.59,174.78 0 top
R202  2201  [R0805]  137.04,166.4 180 top
R203  1002  [R0805]  113.16,133 180 top
R204  1002  [R0805]  151.52,178.1 0 top
R205  102  [R0805]  148.47,178.1 0 top
R206  2702  [R0805]  145.42,177.98 180 top
R207  1002  [R0805]  152.02,167.67 180 top
R208  1002  [R0805]  155.07,167.67 180 top
R209  R_user  [R0805']  148.47,113.84 270 top
R210  104  [R0805]  115.2,122.3 180 top
R211  104  [R0805]  118.5,117.5 180 top
R212  104  [R0805]  121.6,120.1 180 top
R213  13  [R1206]  140.4,167.2 90 top
R214  2201  [R0805]  144.6,170.36 270 top
R215  100  [R0805]  132.9,114.1 180 top
R216  13  [R1206]  127.3,119.1 90 top
R217  4701  [R0805]  117.62,195.43 270 top
R218  104  [R0805]  116.21,179.37 90 top
R219  100  [R0805]  133.48,190.29 90 top
R220  100  [R0805]  129.93,190.29 270 top
R221  47  [V235/17_1MM]  90.79,198.15 0 bottom
R222  13  [R1206]  71.74,152.3 270 top
R223  47  [V235/17_1MM]  70.91,198.15 0 bottom
R224  104  [R0805]  68.56,187.61 180 top
R225  104  [R0805]  71.55,187.61 180 top
R226  104  [R0805]  74.72,187.61 180 top
R227  4701  [R0805]  105.52,167.67 0 top
R228  1002  [R0805]  105.01,172.5 180 top
R229  1002  [R0805]  80.25,153.7 270 top
R230  1502  [R0805]  105.77,149 90 top
R231  104  [R0805]  89.14,148.05 0 top
R232  104  [R0805]  89.14,152.75 0 top
R233  1502  [R0805]  97.14,145.7 270 top
R234  1002  [R0805]  95.8,143.03 270 top
R235  2201  [R0805]  91.23,143.03 90 top
R236  1002  [R0805]  91.36,149.45 0 top
R237  4701  [R0805]  85.07,154.72 90 top
R238  2702  [R0805]  105.77,156.88 270 top
R239  102  [R0805]  99.3,108.36 0 top
R240  R_user  [R0805']  99.81,108.87 180 bottom
R241  102  [R0805]  94.6,157.51 90 top
R242  (101)  [R0805]  84.31,133.51 0 top
R243  (1000)  [R0805]  100.44,143.03 90 top
R244  102  [R0805]  90.53,188.88 180 top
R245  13  [R1206]  95.36,119.16 270 top
R246  13  [R1206]  99.68,122.46 270 top
R247  2702  [R0805]  105.77,151.54 90 top
R248  4701  [R0805]  92.82,173.81 0 top
R249  100  [R0805]  85.9,178.66 180 top
R250  104  [R0805]  86.85,174.53 0 top
R251  104  [R0805]  73.77,178.34 0 top
R252  (1002)  [R0805]  69.83,165.77 90 top
R253  2702  [R0805]  78.72,167.42 0 top
R254  47  [V235/17_1MM]  90.28,192.56 0 bottom
R255  47  [V235/17_1MM]  70.4,192.56 180 bottom
R256  2702  [R0805]  71.99,174.78 0 top
R257  2201  [R0805]  84.44,166.4 180 top
R258  1002  [R0805]  60.56,133 180 top
R259  1002  [R0805]  98.92,178.1 0 top
R260  102  [R0805]  95.87,178.1 0 top
R261  2702  [R0805]  92.82,177.98 180 top
R262  1002  [R0805]  99.42,167.67 180 top
R263  1002  [R0805]  102.47,167.67 180 top
R264  R_user  [R0805']  95.87,113.84 270 top
R265  104  [R0805]  62.6,122.3 180 top
R266  104  [R0805]  65.9,117.5 180 top
R267  104  [R0805]  69,120.1 180 top
R268  13  [R1206]  87.8,167.2 90 top
R269  2201  [R0805]  92,170.36 270 top
R270  100  [R0805]  80.3,114.1 180 top
R271  13  [R1206]  74.7,119.1 90 top
R272  4701  [R0805]  65.02,195.43 270 top
R273  104  [R0805]  63.61,179.37 90 top
R274  100  [R0805]  80.88,190.29 90 top
R275  100  [R0805]  77.33,190.29 270 top
R276  47  [V235/17_1MM]  38.19,198.15 0 bottom
R277  13  [R1206]  19.14,152.3 270 top
R278  47  [V235/17_1MM]  18.31,198.15 0 bottom
R279  104  [R0805]  15.96,187.61 180 top
R280  104  [R0805]  18.95,187.61 180 top
R281  104  [R0805]  22.12,187.61 180 top
R282  4701  [R0805]  52.92,167.67 0 top
R283  1002  [R0805]  52.41,172.5 180 top
R284  1002  [R0805]  27.65,153.7 270 top
R285  1502  [R0805]  53.17,149 90 top
R286  104  [R0805]  36.54,148.05 0 top
R287  104  [R0805]  36.54,152.75 0 top
R288  1502  [R0805]  44.54,145.7 270 top
R289  1002  [R0805]  43.2,143.03 270 top
R290  2201  [R0805]  38.63,143.03 90 top
R291  1002  [R0805]  38.76,149.45 0 top
R292  4701  [R0805]  32.47,154.72 90 top
R293  2702  [R0805]  53.17,156.88 270 top
R294  102  [R0805]  46.7,108.36 0 top
R295  R_user  [R0805']  47.2,108.87 180 bottom
R296  102  [R0805]  42,157.51 90 top
R297  (101)  [R0805]  31.71,133.51 0 top
R298  (1000)  [R0805]  47.84,143.03 90 top
R299  102  [R0805]  37.93,188.88 180 top
R300  13  [R1206]  42.76,119.16 270 top
R301  13  [R1206]  47.08,122.46 270 top
R302  2702  [R0805]  53.17,151.54 90 top
R303  4701  [R0805]  40.22,173.81 0 top
R304  100  [R0805]  33.3,178.66 180 top
R305  104  [R0805]  34.25,174.53 0 top
R306  104  [R0805]  21.17,178.34 0 top
R307  (1002)  [R0805]  17.23,165.77 90 top
R308  2702  [R0805]  26.12,167.42 0 top
R309  47  [V235/17_1MM]  37.68,192.56 0 bottom
R310  47  [V235/17_1MM]  17.8,192.56 180 bottom
R311  2702  [R0805]  19.39,174.78 0 top
R312  2201  [R0805]  31.84,166.4 180 top
R313  1002  [R0805]  7.96,133 180 top
R314  1002  [R0805]  46.32,178.1 0 top
R315  102  [R0805]  43.27,178.1 0 top
R316  2702  [R0805]  40.22,177.98 180 top
R317  1002  [R0805]  46.82,167.67 180 top
R318  1002  [R0805]  49.87,167.67 180 top
R319  R_user  [R0805']  43.27,113.84 270 top
R320  104  [R0805]  10,122.3 180 top
R321  104  [R0805]  13.3,117.5 180 top
R322  104  [R0805]  16.4,120.1 180 top
R323  13  [R1206]  35.2,167.2 90 top
R324  2201  [R0805]  39.4,170.36 270 top
R325  100  [R0805]  27.7,114.1 180 top
R326  13  [R1206]  22.1,119.1 90 top
R327  4701  [R0805]  12.42,195.43 270 top
R328  104  [R0805]  11.01,179.37 90 top
R329  100  [R0805]  28.28,190.29 90 top
R330  100  [R0805]  24.73,190.29 270 top
SJ1  [SJ]  75.29,76.24 90 bottom
SJ2  [SJ]  22.69,76.24 90 bottom
SJ3  [SJ]  127.89,172.24 90 bottom
SJ4  [SJ]  75.29,172.24 90 bottom
SJ5  [SJ]  22.69,172.24 90 bottom
SJ101  [SJ]  127.89,76.24 90 bottom
SJMP  [SJ']  123.58,103.18 270 top
SJMP1  [SJ']  70.98,103.18 270 top
SJMP2  [SJ']  18.38,103.18 270 top
SJMP3  [SJ']  123.58,199.18 270 top
SJMP4  [SJ']  70.98,199.18 270 top
SJMP5  [SJ']  18.38,199.18 270 top
START  TPSB2.0  [B2.0]  140.59,93.01 90 top
START1  TPSB2.0  [B2.0]  87.99,93.01 90 top
START2  TPSB2.0  [B2.0]  35.39,93.01 90 top
START3  TPSB2.0  [B2.0]  140.59,189.01 90 top
START4  TPSB2.0  [B2.0]  87.99,189.01 90 top
START5  TPSB2.0  [B2.0]  35.39,189.01 90 top
TP1  TPSB2.0  [B2.0]  154.94,30.27 90 top
TP2  TPSB2.0  [B2.0]  154.31,21.38 90 top
TP3  TPSB2.0  [B2.0]  149.87,27.41 90 top
TP4  TPSB2.0  [B2.0]  144.47,24.87 90 top
TP5  TPSB2.0  [B2.0]  139.07,27.41 90 top
TP6  TPSB2.0  [B2.0]  137.48,24.87 90 top
TP7  TPSB2.0  [B2.0]  131.77,27.73 90 top
TP8  TPSB2.0  [B2.0]  130.5,24.87 90 top
TP9  TPSB2.0  [B2.0]  126.69,30.27 90 top
TP10  TPSB2.0  [B2.0]  124.15,24.87 90 top
TP11  TPSB2.0  [B2.0]  119.7,30.59 90 top
TP12  TPSB2.0  [B2.0]  154.94,35.67 90 top
TP13  TPSB2.0  [B2.0]  116.46,29.51 90 top
TP14  TPSB2.0  [B2.0]  102.34,30.27 90 top
TP15  TPSB2.0  [B2.0]  101.71,21.38 90 top
TP16  TPSB2.0  [B2.0]  151.45,35.67 90 top
TP17  TPSB2.0  [B2.0]  147.96,35.67 90 top
TP18  TPSB2.0  [B2.0]  144.47,29.95 90 top
TP19  TPSB2.0  [B2.0]  141.93,41.07 90 top
TP20  TPSB2.0  [B2.0]  97.27,27.41 90 top
TP21  TPSB2.0  [B2.0]  137.48,30.27 90 top
TP22  TPSB2.0  [B2.0]  133.99,35.67 90 top
TP23  TPSB2.0  [B2.0]  129.86,35.67 90 top
TP24  TPSB1,27  [B1,27]  127.96,40.75 90 top
TP25  TPSB2.0  [B2.0]  124.02,30.33 90 top
TP26  TPSB2.0  [B2.0]  129.42,30.02 90 top
TP27  TPSB2.0  [B2.0]  91.87,24.87 90 top
TP28  TPSB2.0  [B2.0]  86.47,27.41 90 top
TP29  TPSB2.0  [B2.0]  84.88,24.87 90 top
TP30  TPSB2.0  [B2.0]  79.17,27.73 90 top
TP31  TPSB2.0  [B2.0]  77.9,24.87 90 top
TP32  TPSB2.0  [B2.0]  74.09,30.27 90 top
TP33  TPSB2.0  [B2.0]  71.55,24.87 90 top
TP34  TPSB2.0  [B2.0]  67.1,30.59 90 top
TP35  TPSB2.0  [B2.0]  98.85,35.67 90 top
TP36  TPSB2.0  [B2.0]  95.36,35.67 90 top
TP37  TPSB2.0  [B2.0]  91.87,29.95 90 top
TP38  TPSB2.0  [B2.0]  89.33,41.07 90 top
TP39  TPSB2.0  [B2.0]  84.88,30.27 90 top
TP40  TPSB2.0  [B2.0]  81.39,35.67 90 top
TP41  TPSB2.0  [B2.0]  77.26,35.67 90 top
TP42  TPSB1,27  [B1,27]  75.36,40.75 90 top
TP43  TPSB2.0  [B2.0]  71.42,30.33 90 top
TP44  TPSB2.0  [B2.0]  76.82,30.02 90 top
TP45  TPSB2.0  [B2.0]  102.34,35.67 90 top
TP46  TPSB2.0  [B2.0]  63.86,29.51 90 top
TP47  TPSB2.0  [B2.0]  49.74,30.27 90 top
TP48  TPSB2.0  [B2.0]  49.11,21.38 90 top
TP49  TPSB2.0  [B2.0]  44.66,27.41 90 top
TP50  TPSB2.0  [B2.0]  39.27,24.87 90 top
TP51  TPSB2.0  [B2.0]  33.87,27.41 90 top
TP52  TPSB2.0  [B2.0]  32.28,24.87 90 top
TP53  TPSB2.0  [B2.0]  26.57,27.73 90 top
TP54  TPSB2.0  [B2.0]  25.3,24.87 90 top
TP55  TPSB2.0  [B2.0]  21.49,30.27 90 top
TP56  TPSB2.0  [B2.0]  18.95,24.87 90 top
TP57  TPSB2.0  [B2.0]  14.5,30.59 90 top
TP58  TPSB2.0  [B2.0]  46.25,35.67 90 top
TP59  TPSB2.0  [B2.0]  42.76,35.67 90 top
TP60  TPSB2.0  [B2.0]  39.27,29.95 90 top
TP61  TPSB2.0  [B2.0]  36.73,41.07 90 top
TP62  TPSB2.0  [B2.0]  32.28,30.27 90 top
TP63  TPSB2.0  [B2.0]  28.79,35.67 90 top
TP64  TPSB2.0  [B2.0]  24.66,35.67 90 top
TP65  TPSB1,27  [B1,27]  22.76,40.75 90 top
TP66  TPSB2.0  [B2.0]  18.82,30.33 90 top
TP67  TPSB2.0  [B2.0]  24.22,30.02 90 top
TP68  TPSB2.0  [B2.0]  49.74,35.67 90 top
TP69  TPSB2.0  [B2.0]  11.26,29.51 90 top
TP70  TPSB2.0  [B2.0]  154.94,126.27 90 top
TP71  TPSB2.0  [B2.0]  154.31,117.38 90 top
TP72  TPSB2.0  [B2.0]  149.87,123.41 90 top
TP73  TPSB2.0  [B2.0]  144.47,120.87 90 top
TP74  TPSB2.0  [B2.0]  139.07,123.41 90 top
TP75  TPSB2.0  [B2.0]  137.48,120.87 90 top
TP76  TPSB2.0  [B2.0]  131.77,123.73 90 top
TP77  TPSB2.0  [B2.0]  130.5,120.87 90 top
TP78  TPSB2.0  [B2.0]  126.69,126.27 90 top
TP79  TPSB2.0  [B2.0]  124.15,120.87 90 top
TP80  TPSB2.0  [B2.0]  119.7,126.59 90 top
TP81  TPSB2.0  [B2.0]  151.45,131.67 90 top
TP82  TPSB2.0  [B2.0]  147.96,131.67 90 top
TP83  TPSB2.0  [B2.0]  144.47,125.95 90 top
TP84  TPSB2.0  [B2.0]  141.93,137.06 90 top
TP85  TPSB2.0  [B2.0]  137.48,126.27 90 top
TP86  TPSB2.0  [B2.0]  133.99,131.67 90 top
TP87  TPSB2.0  [B2.0]  129.86,131.67 90 top
TP88  TPSB1,27  [B1,27]  127.96,136.75 90 top
TP89  TPSB2.0  [B2.0]  124.02,126.33 90 top
TP90  TPSB2.0  [B2.0]  129.42,126.02 90 top
TP91  TPSB2.0  [B2.0]  154.94,131.67 90 top
TP92  TPSB2.0  [B2.0]  116.46,125.51 90 top
TP93  TPSB2.0  [B2.0]  102.34,126.27 90 top
TP94  TPSB2.0  [B2.0]  101.71,117.38 90 top
TP95  TPSB2.0  [B2.0]  97.27,123.41 90 top
TP96  TPSB2.0  [B2.0]  91.87,120.87 90 top
TP97  TPSB2.0  [B2.0]  86.47,123.41 90 top
TP98  TPSB2.0  [B2.0]  84.88,120.87 90 top
TP99  TPSB2.0  [B2.0]  79.17,123.73 90 top
TP100  TPSB2.0  [B2.0]  77.9,120.87 90 top
TP101  TPSB2.0  [B2.0]  74.09,126.27 90 top
TP102  TPSB2.0  [B2.0]  71.55,120.87 90 top
TP103  TPSB2.0  [B2.0]  67.1,126.59 90 top
TP104  TPSB2.0  [B2.0]  98.85,131.67 90 top
TP105  TPSB2.0  [B2.0]  95.36,131.67 90 top
TP106  TPSB2.0  [B2.0]  91.87,125.95 90 top
TP107  TPSB2.0  [B2.0]  89.33,137.06 90 top
TP108  TPSB2.0  [B2.0]  84.88,126.27 90 top
TP109  TPSB2.0  [B2.0]  81.39,131.67 90 top
TP110  TPSB2.0  [B2.0]  77.26,131.67 90 top
TP111  TPSB1,27  [B1,27]  75.36,136.75 90 top
TP112  TPSB2.0  [B2.0]  71.42,126.33 90 top
TP113  TPSB2.0  [B2.0]  76.82,126.02 90 top
TP114  TPSB2.0  [B2.0]  102.34,131.67 90 top
TP115  TPSB2.0  [B2.0]  63.86,125.51 90 top
TP116  TPSB2.0  [B2.0]  49.74,126.27 90 top
TP117  TPSB2.0  [B2.0]  49.11,117.38 90 top
TP118  TPSB2.0  [B2.0]  44.66,123.41 90 top
TP119  TPSB2.0  [B2.0]  39.27,120.87 90 top
TP120  TPSB2.0  [B2.0]  33.87,123.41 90 top
TP121  TPSB2.0  [B2.0]  32.28,120.87 90 top
TP122  TPSB2.0  [B2.0]  26.57,123.73 90 top
TP123  TPSB2.0  [B2.0]  25.3,120.87 90 top
TP124  TPSB2.0  [B2.0]  21.49,126.27 90 top
TP125  TPSB2.0  [B2.0]  18.95,120.87 90 top
TP126  TPSB2.0  [B2.0]  14.5,126.59 90 top
TP127  TPSB2.0  [B2.0]  46.25,131.67 90 top
TP128  TPSB2.0  [B2.0]  42.76,131.67 90 top
TP129  TPSB2.0  [B2.0]  39.27,125.95 90 top
TP130  TPSB2.0  [B2.0]  36.73,137.06 90 top
TP131  TPSB2.0  [B2.0]  32.28,126.27 90 top
TP132  TPSB2.0  [B2.0]  28.79,131.67 90 top
TP133  TPSB2.0  [B2.0]  24.66,131.67 90 top
TP134  TPSB1,27  [B1,27]  22.76,136.75 90 top
TP135  TPSB2.0  [B2.0]  18.82,126.33 90 top
TP136  TPSB2.0  [B2.0]  24.22,126.02 90 top
TP137  TPSB2.0  [B2.0]  49.74,131.67 90 top
TP138  TPSB2.0  [B2.0]  11.26,125.51 90 top
U$1  [CE_10.00]  159.26,81.83 270 bottom
U$2  [CE_10.00]  138.73,39.67 90 top
U$3  [CE_10.00]  106.66,81.83 270 bottom
U$4  [CE_10.00]  86.13,39.67 90 top
U$5  [CE_10.00]  54.06,81.83 270 bottom
U$6  [CE_10.00]  33.53,39.67 90 top
U$7  [CE_10.00]  159.26,177.83 270 bottom
U$8  [CE_10.00]  138.73,135.67 90 top
U$9  [CE_10.00]  106.66,177.83 270 bottom
U$10  [CE_10.00]  86.13,135.67 90 top
U$11  [CE_10.00]  54.06,177.83 270 bottom
U$12  [CE_10.00]  33.53,135.67 90 top
X1  [24-PIN_V2]  83.1,76.56 180 bottom
X2  22-23-2051  [22-23-2051]  59.16,26.78 90 bottom
X3  22-23-2021  [22-23-2021]  100.44,16.93 0 bottom
X4  [24-PIN_V2]  30.5,76.56 180 bottom
X5  22-23-2051  [22-23-2051]  6.57,26.78 90 bottom
X6  22-23-2021  [22-23-2021]  47.84,16.93 0 bottom
X7  [24-PIN_V2]  135.7,172.56 180 bottom
X8  22-23-2051  [22-23-2051]  111.77,122.78 90 bottom
X9  22-23-2021  [22-23-2021]  153.04,112.94 0 bottom
X10  [24-PIN_V2]  83.1,172.56 180 bottom
X11  22-23-2051  [22-23-2051]  59.16,122.78 90 bottom
X12  22-23-2021  [22-23-2021]  100.44,112.94 0 bottom
X13  [24-PIN_V2]  30.5,172.56 180 bottom
X14  22-23-2051  [22-23-2051]  6.57,122.78 90 bottom
X15  22-23-2021  [22-23-2021]  47.84,112.94 0 bottom
X101  [24-PIN_V2]  135.7,76.56 180 bottom
X102  22-23-2021  [22-23-2021]  153.04,16.93 0 bottom
X103  22-23-2051  [22-23-2051]  111.77,26.78 90 bottom

## Tracks (layer width: path | path; a pad name or v marks a point on that pad's centre or on a via)
+10V  (via drill 0.6)  (17 unrouted)
  Top 0.406: 116.84,78.53 114.43,76.12 IC111.3 111.5,76.12 111.13,75.75 111.13,73.97 111.38,73.72 112.62,73.72 IC111.5 | 116.97,78.66 IC111.16 | 122.81,76.88 123.7,77.89 R145.2 | 116.84,75.36 116.84,75.23 117.23,74.85 IC111.13 120.66,74.85 121.29,75.61 122.43,76.88 122.81,76.88 | 116.84,75.36 116.84,78.53 | 116.84,78.53 116.97,78.66 | IC110.4 124.85,71.42 125.86,72.43 v125.86,72.94 125.86,74.09 127.01,75.23 IC110.8 | 116.97,78.66 117.21,82.2 117.21,83.89 115.7,85.4 115.7,90.73 116.21,91.5 116.21,93.79 116.72,94.3 122.31,94.3 123.07,94.47 123.62,94.47 IC104.1 | v122.94,77.64 122.94,76.88 122.81,76.88 | 116.84,75.36 115.07,76.12 114.69,76.12 114.69,76.24 | R10.2 118.94,83.37 C102.1 | 64.25,78.53 61.83,76.12 IC7.3 58.9,76.12 58.53,75.75 58.53,73.97 58.78,73.72 60.02,73.72 IC7.5 | 64.37,78.66 IC7.16 | 70.21,76.88 71.1,77.89 R47.2 | 64.25,75.36 64.25,75.23 64.63,74.85 IC7.13 68.06,74.85 68.69,75.61 69.83,76.88 70.21,76.88 | 64.25,75.36 64.25,78.53 | 64.25,78.53 64.37,78.66 | IC6.4 72.25,71.42 73.26,72.43 v73.26,72.94 73.26,74.09 74.41,75.23 IC6.8 | 64.37,78.66 64.61,82.2 64.61,83.89 63.1,85.4 63.1,90.73 63.61,91.5 63.61,93.79 64.12,94.3 69.71,94.3 70.47,94.47 71.02,94.47 IC8.1 | v70.34,77.64 70.34,76.88 70.21,76.88 | 64.25,75.36 62.47,76.12 62.09,76.12 62.09,76.24 | R64.2 66.34,83.37 C9.1 | 11.64,78.53 9.23,76.12 IC16.3 6.3,76.12 5.93,75.75 5.93,73.97 6.18,73.72 7.42,73.72 IC16.5 | 11.77,78.66 IC16.16 | 17.61,76.88 18.5,77.89 R139.2 | 11.64,75.36 11.64,75.23 12.03,74.85 IC16.13 15.46,74.85 16.09,75.61 17.23,76.88 17.61,76.88 | 11.64,75.36 11.64,78.53 | 11.64,78.53 11.77,78.66
  Top 0.406: IC15.4 19.65,71.42 20.66,72.43 v20.66,72.94 20.66,74.09 21.8,75.23 IC15.8 | 11.77,78.66 12.01,82.2 12.01,83.89 10.5,85.4 10.5,90.73 11.01,91.5 11.01,93.79 11.52,94.3 17.11,94.3 17.87,94.47 18.42,94.47 IC17.1 | v17.74,77.64 17.74,76.88 17.61,76.88 | 11.64,75.36 9.87,76.12 9.49,76.12 9.49,76.24 | R163.2 13.74,83.37 C22.1 | 116.84,174.53 114.43,172.12 IC25.3 111.5,172.12 111.13,171.75 111.13,169.97 111.38,169.72 112.62,169.72 IC25.5 | 116.97,174.66 IC25.16 | 122.81,172.88 123.7,173.89 R201.2 | 116.84,171.35 116.84,171.23 117.23,170.85 IC25.13 120.66,170.85 121.29,171.61 122.43,172.88 122.81,172.88 | 116.84,171.35 116.84,174.53 | 116.84,174.53 116.97,174.66 | IC24.4 124.85,167.42 125.86,168.43 v125.86,168.94 125.86,170.08 127.01,171.23 IC24.8 | 116.97,174.66 117.21,178.2 117.21,179.89 115.7,181.4 115.7,186.73 116.21,187.5 116.21,189.79 116.72,190.3 122.31,190.3 123.07,190.47 123.62,190.47 IC26.1 | v122.94,173.64 122.94,172.88 122.81,172.88 | 116.84,171.35 115.07,172.12 114.69,172.12 114.69,172.24 | R218.2 118.94,179.37 C34.1 | 64.25,174.53 61.83,172.12 IC34.3 58.9,172.12 58.53,171.75 58.53,169.97 58.78,169.72 60.02,169.72 IC34.5 | 64.37,174.66 IC34.16 | 70.21,172.88 71.1,173.89 R256.2 | 64.25,171.35 64.25,171.23 64.63,170.85 IC34.13 68.06,170.85 68.69,171.61 69.83,172.88 70.21,172.88 | 64.25,171.35 64.25,174.53 | 64.25,174.53 64.37,174.66 | IC33.4 72.25,167.42 73.26,168.43 v73.26,168.94 73.26,170.08 74.41,171.23 IC33.8 | 64.37,174.66 64.61,178.2 64.61,179.89 63.1,181.4 63.1,186.73 63.61,187.5 63.61,189.79 64.12,190.3 69.71,190.3 70.47,190.47 71.02,190.47 IC35.1
  Top 0.406: v70.34,173.64 70.34,172.88 70.21,172.88 | 64.25,171.35 62.47,172.12 62.09,172.12 62.09,172.24 | R273.2 66.34,179.37 C46.1 | 11.64,174.53 9.23,172.12 IC43.3 6.3,172.12 5.93,171.75 5.93,169.97 6.18,169.72 7.42,169.72 IC43.5 | 11.77,174.66 IC43.16 | 17.61,172.88 18.5,173.89 R311.2 | 11.64,171.35 11.64,171.23 12.03,170.85 IC43.13 15.46,170.85 16.09,171.61 17.23,172.88 17.61,172.88 | 11.64,171.35 11.64,174.53 | 11.64,174.53 11.77,174.66 | IC42.4 19.65,167.42 20.66,168.43 v20.66,168.94 20.66,170.08 21.8,171.23 IC42.8 | 11.77,174.66 12.01,178.2 12.01,179.89 10.5,181.4 10.5,186.73 11.01,187.5 11.01,189.79 11.52,190.3 17.11,190.3 17.87,190.47 18.42,190.47 IC44.1 | v17.74,173.64 17.74,172.88 17.61,172.88 | 11.64,171.35 9.87,172.12 9.49,172.12 9.49,172.24 | R328.2 13.74,179.37 C58.1
  Bottom 0.406: v122.94,77.64 123.7,77.64 125.86,75.48 v125.86,72.94 | v70.34,77.64 71.1,77.64 73.26,75.48 v73.26,72.94 | v17.74,77.64 18.5,77.64 20.66,75.48 v20.66,72.94 | v122.94,173.64 123.7,173.64 125.86,171.48 v125.86,168.94 | v70.34,173.64 71.1,173.64 73.26,171.48 v73.26,168.94 | v17.74,173.64 18.5,173.64 20.66,171.48 v20.66,168.94
  pour Top: 114.43,73.58 114.43,81.34 114.69,81.58 114.94,81.83 115.45,82.1 117.86,82.09 117.86,79.67 117.48,79.29 117.48,73.7 114.56,73.7
  pour Top: 61.83,73.58 61.83,81.34 62.09,81.58 62.34,81.83 62.85,82.1 65.26,82.09 65.26,79.67 64.88,79.29 64.88,73.7 61.96,73.7
  pour Top: 9.23,73.58 9.23,81.34 9.49,81.58 9.74,81.83 10.25,82.1 12.66,82.09 12.66,79.67 12.28,79.29 12.28,73.7 9.36,73.7
  pour Top: 114.43,169.58 114.43,177.34 114.69,177.58 114.94,177.83 115.45,178.1 117.86,178.09 117.86,175.67 117.48,175.29 117.48,169.7 114.56,169.7
  pour Top: 61.83,169.58 61.83,177.34 62.09,177.58 62.34,177.83 62.85,178.1 65.26,178.09 65.26,175.67 64.88,175.29 64.88,169.7 61.96,169.7
  pour Top: 9.23,169.58 9.23,177.34 9.49,177.58 9.74,177.83 10.25,178.1 12.66,178.09 12.66,175.67 12.28,175.29 12.28,169.7 9.36,169.7
+12V  (via drill 0.5, 0.6)  (23 unrouted)
  Top 0.35: 144.53,20 145.04,20.11 | 91.93,20 92.44,20.11 | 39.33,20 39.84,20.11 | 144.53,116 145.04,116.11 | 91.93,116 92.44,116.11 | 39.33,116 39.84,116.11